# EAGLE schematic CanShark (EAGLE 6.5.0)
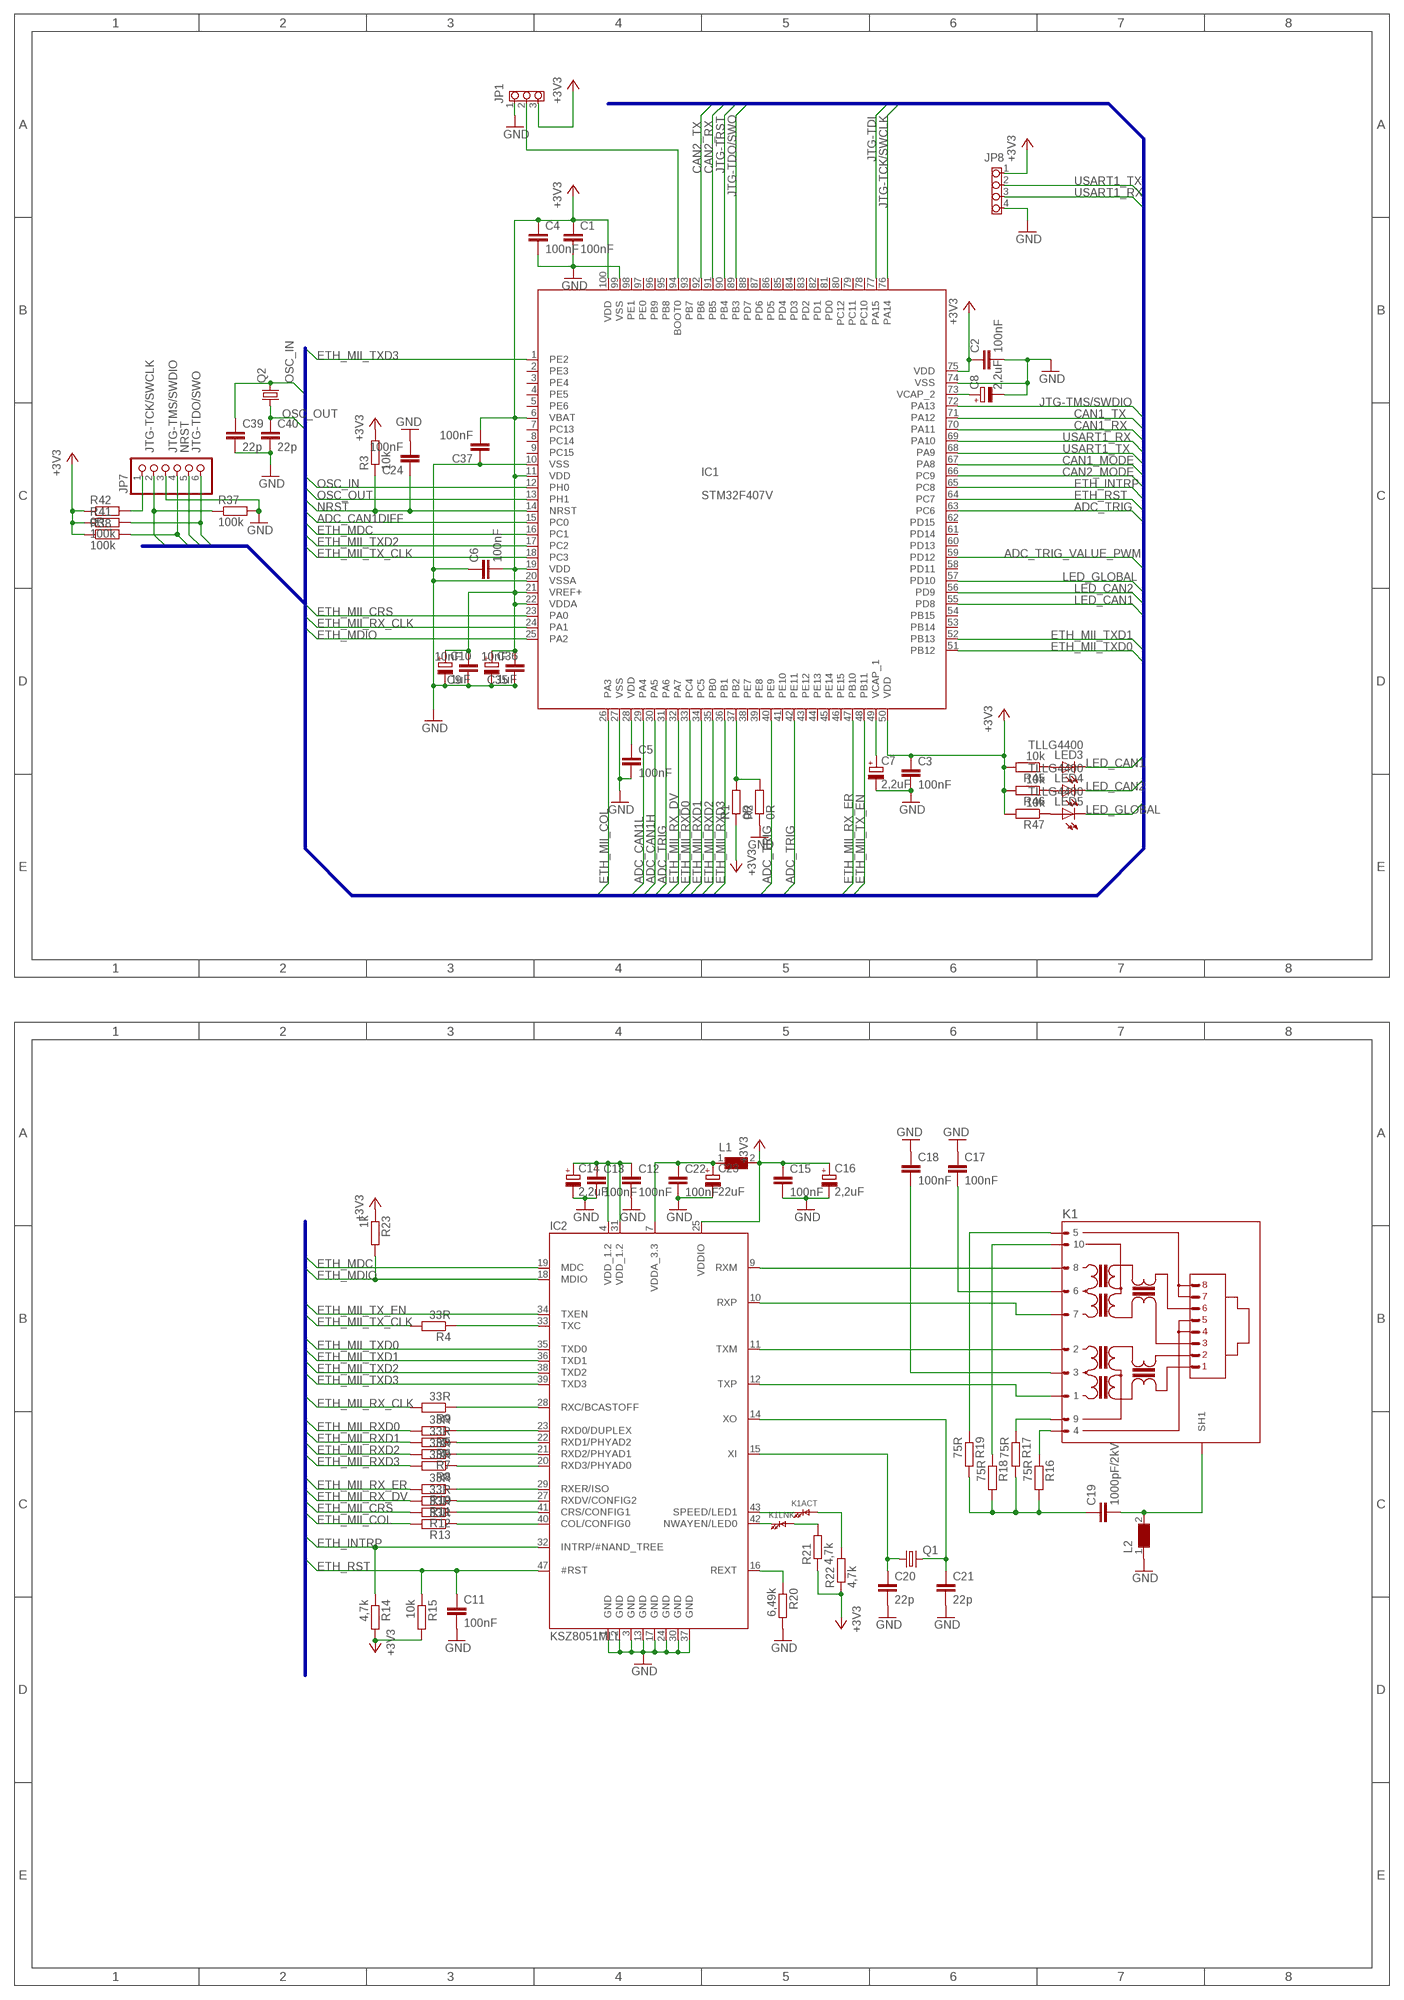
[diagram p0: schematic, sheet 1, part 1 of 3]
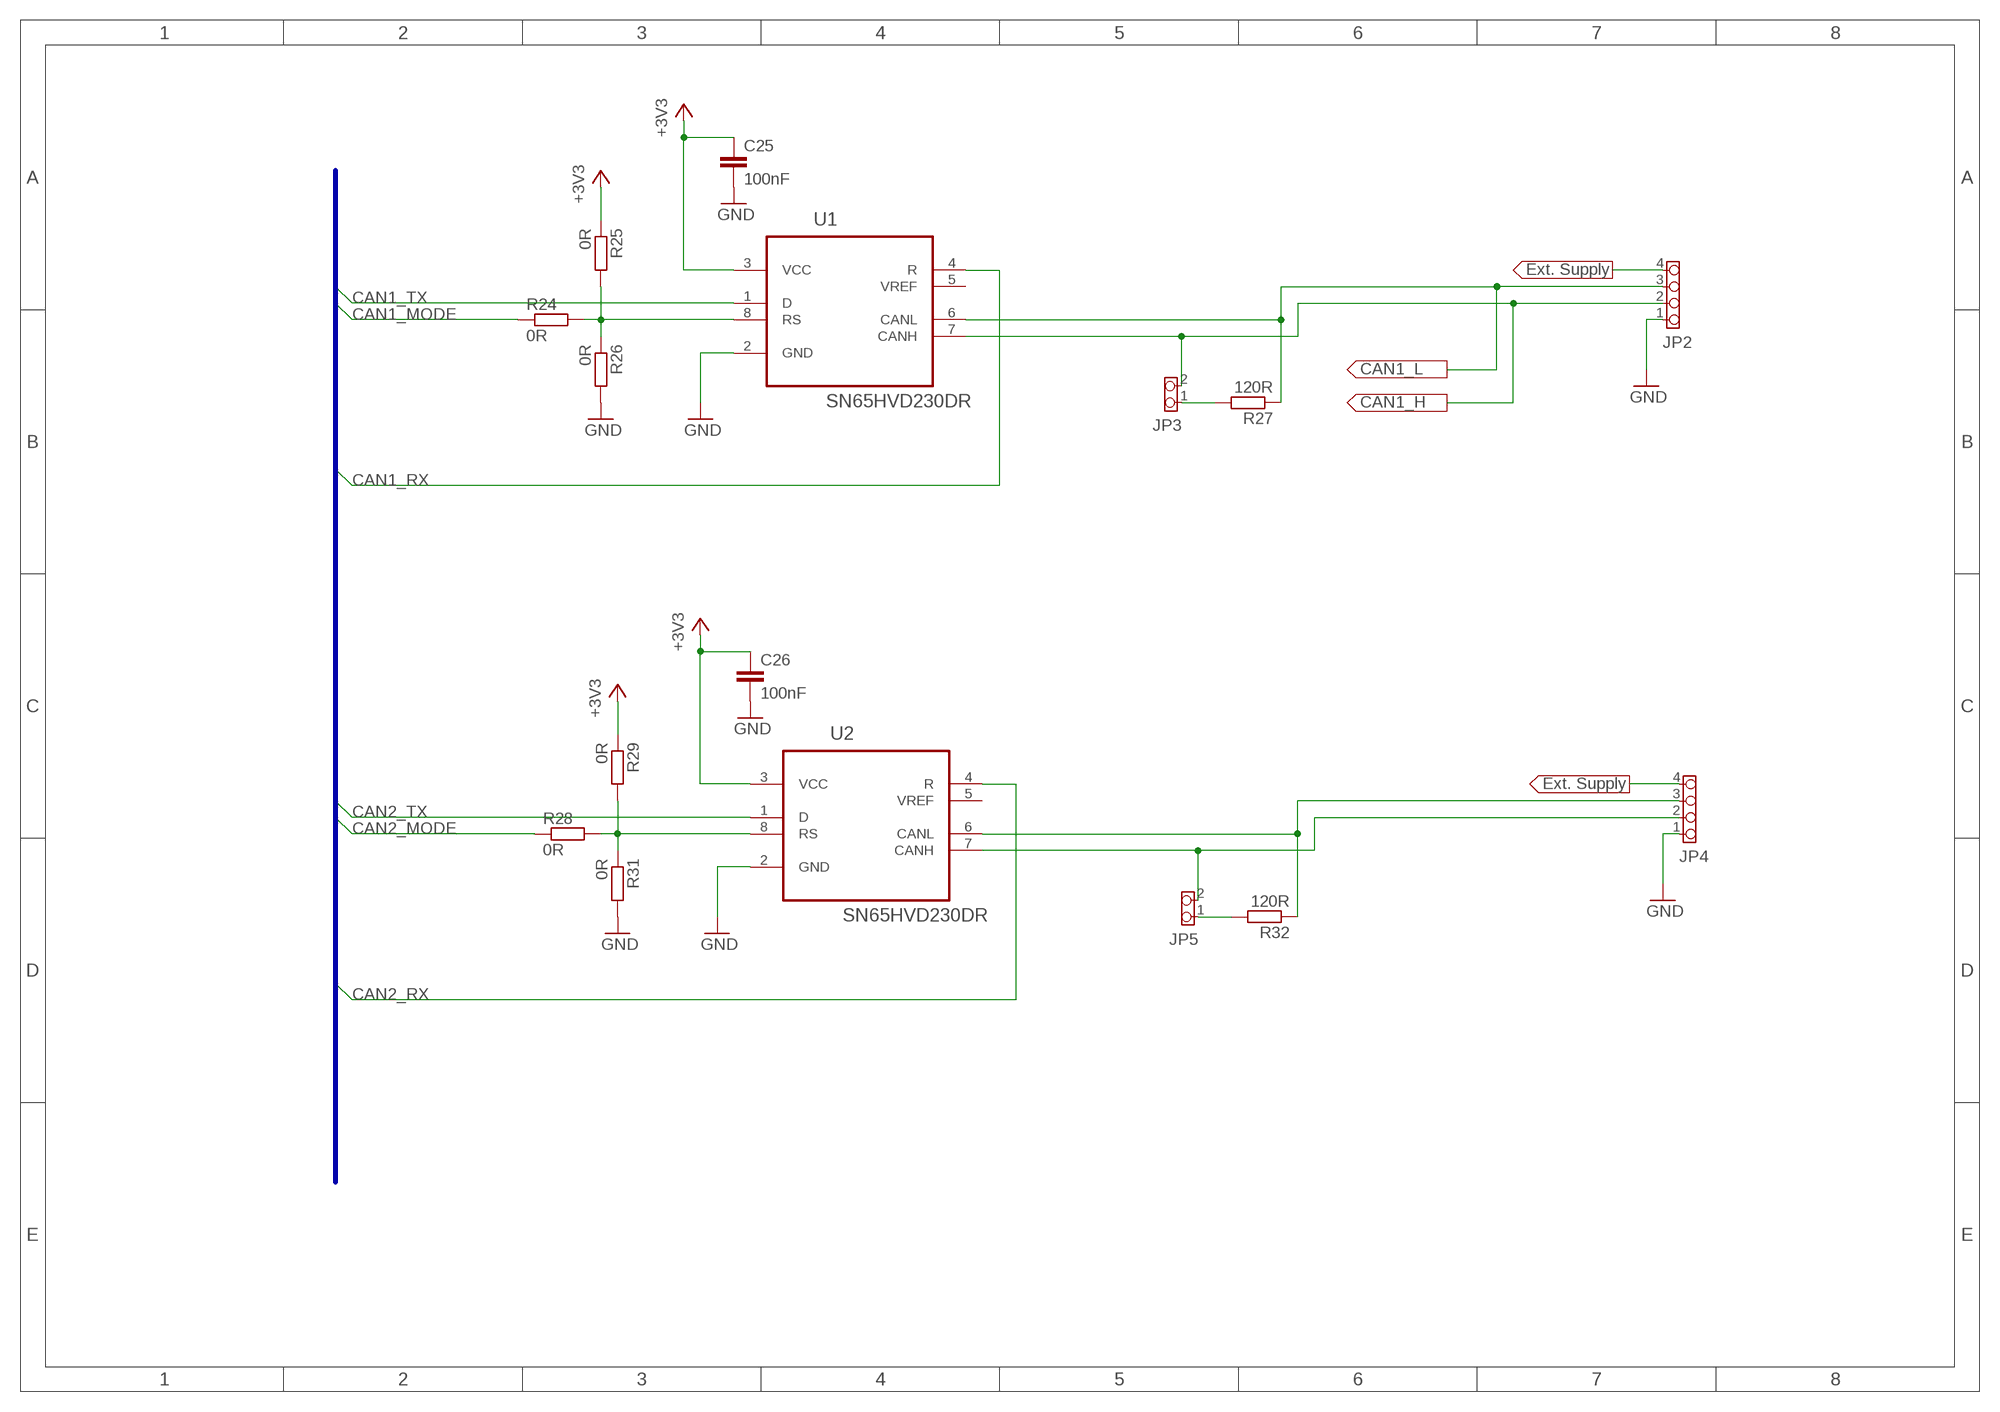
[diagram p1: schematic, sheet 1, part 2 of 3]
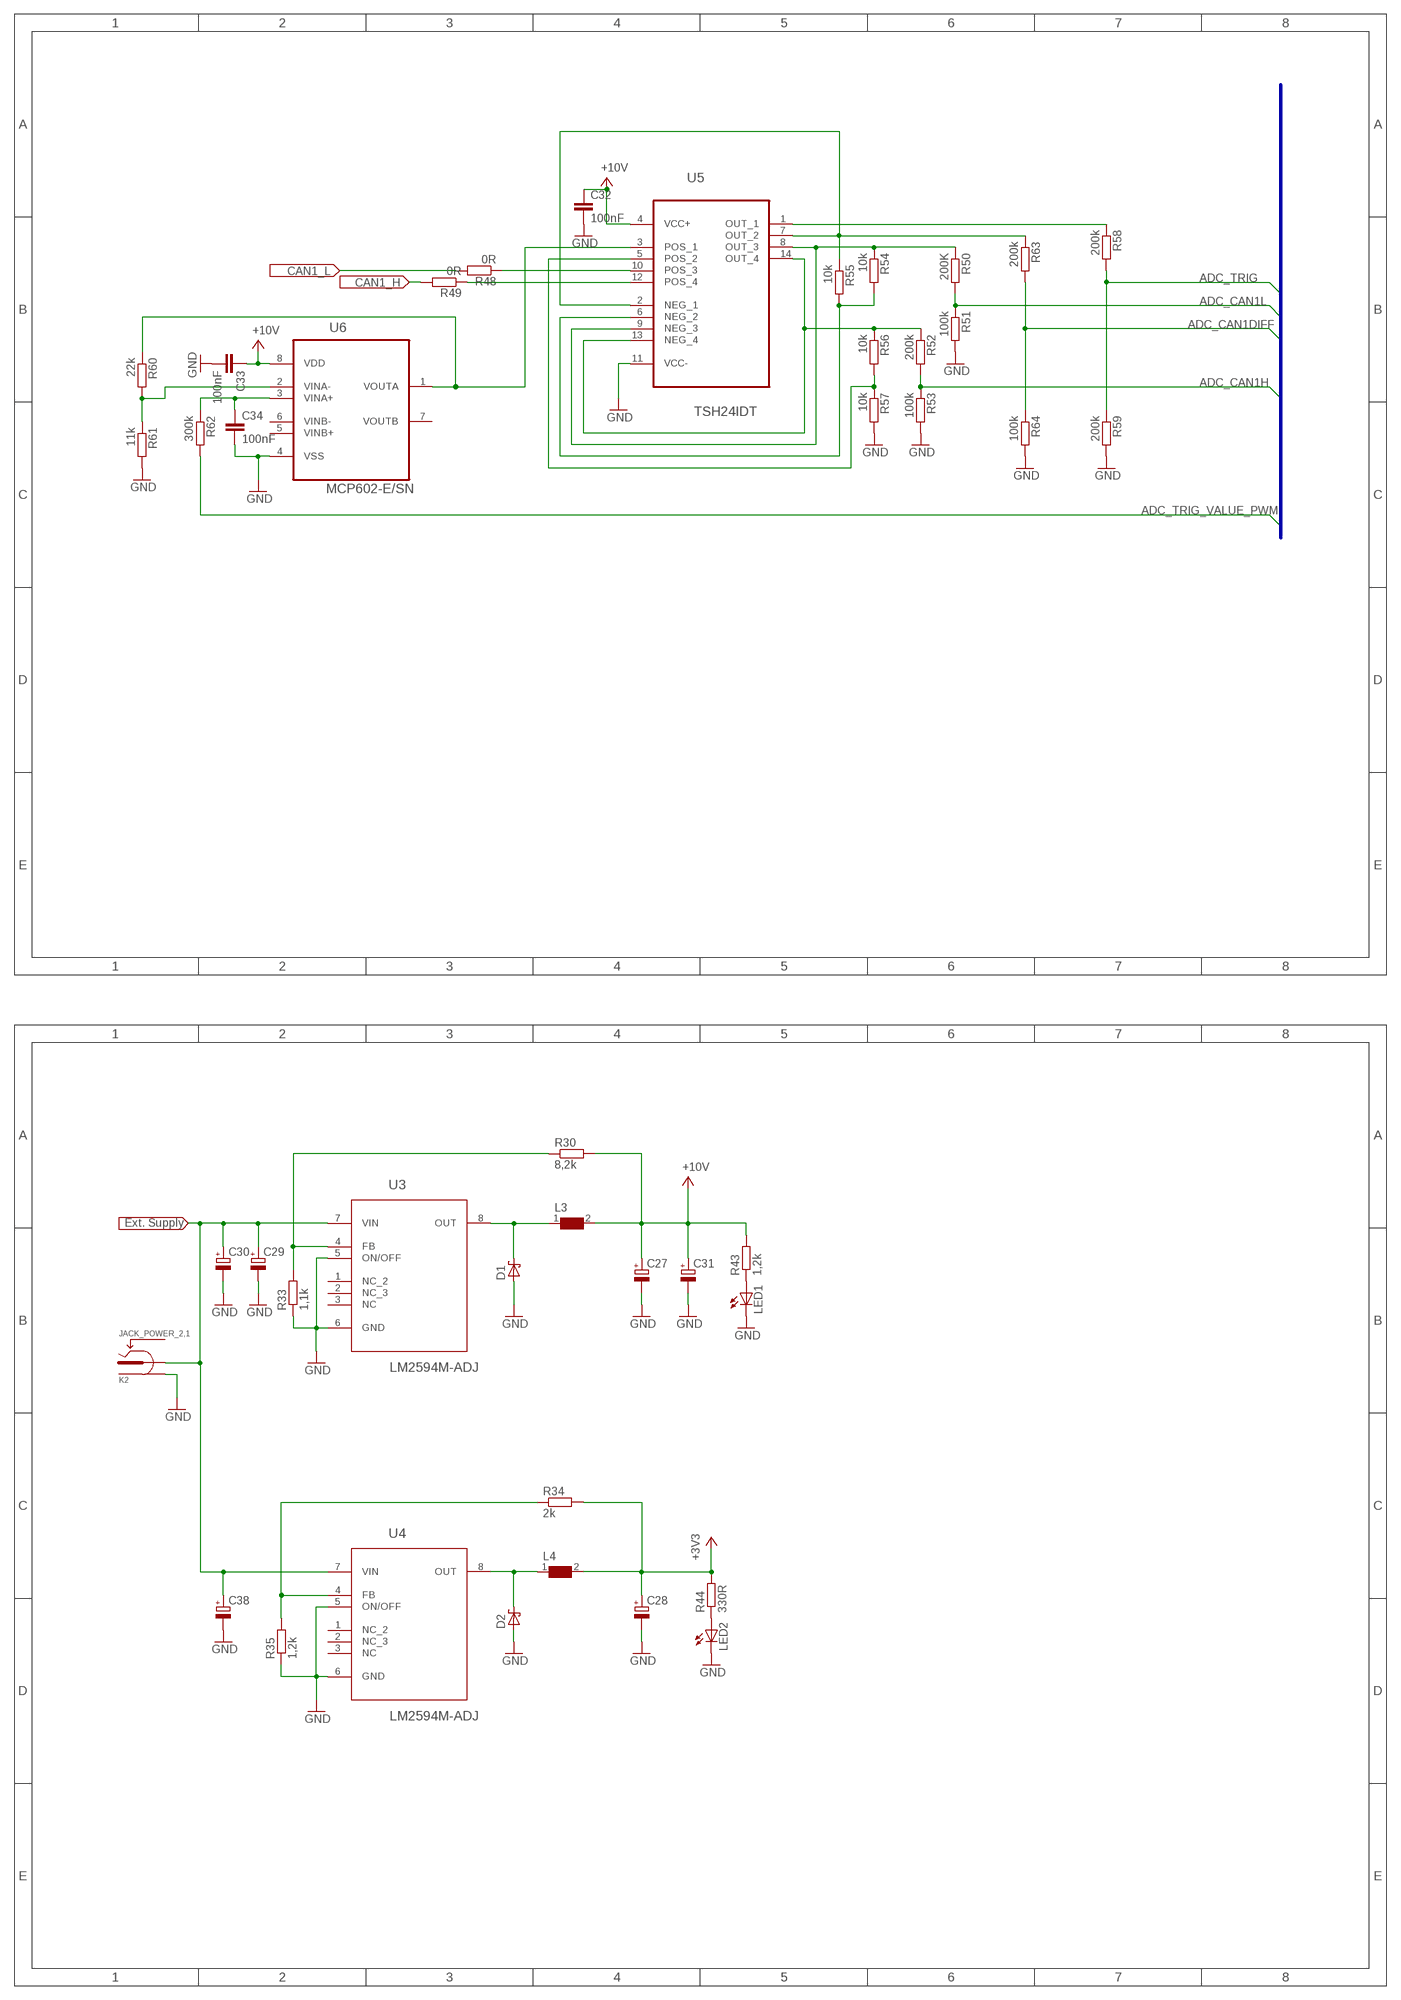
[diagram p2: schematic, sheet 1, part 3 of 3]

## Parts
C1  100nF  KERAMICKYSMD0603  [SMD0603]
C2  100nF  KERAMICKYSMD0603  [SMD0603]
C3  100nF  KERAMICKYSMD0603  [SMD0603]
C4  100nF  KERAMICKYSMD0603  [SMD0603]
C5  100nF  KERAMICKYSMD0603  [SMD0603]
C6  100nF  KERAMICKYSMD0603  [SMD0603]
C7  2,2uF  CPOL-EUSMCA  [SMC_A]
C8  2,2uF  CPOL-EUSMCA  [SMC_A]
C9  10nF  KERAMICKYSMD0603  [SMD0603]
C10  1uF  CPOL-EUSMCA  [SMC_A]
C11  100nF  KERAMICKYSMD0603  [SMD0603]
C12  100nF  KERAMICKYSMD0603  [SMD0603]
C13  100nF  KERAMICKYSMD0603  [SMD0603]
C14  2,2uF  CPOL-EUSMCA  [SMC_A]
C15  100nF  KERAMICKYSMD0603  [SMD0603]
C16  2,2uF  CPOL-EUSMCA  [SMC_A]
C17  100nF  KERAMICKYSMD0603  [SMD0603]
C18  100nF  KERAMICKYSMD0603  [SMD0603]
C19  1000pF/2kV  KERAMICKYSMD1206  [SMD1206]
C20  22p  KERAMICKYSMD0603  [SMD0603]
C21  22p  KERAMICKYSMD0603  [SMD0603]
C22  100nF  KERAMICKYSMD0603  [SMD0603]
C23  22uF  CPOL-EUSMCA  [SMC_A]
C24  100nF  KERAMICKYSMD0603  [SMD0603]
C25  100nF  KERAMICKYSMD0603  [SMD0603]
C26  100nF  KERAMICKYSMD0603  [SMD0603]
C27  CPOL-EUC/6032-28R  [C/6032-28R]
C28  CPOL-EUC/6032-28R  [C/6032-28R]
C29  CPOL-EUC/6032-28R  [C/6032-28R]
C30  CPOL-EUA/3216-18R  [A/3216-18R]
C31  CPOL-EUA/3216-18R  [A/3216-18R]
C32  100nF  KERAMICKYSMD0603  [SMD0603]
C33  100nF  KERAMICKYSMD0603  [SMD0603]
C34  100nF  KERAMICKYSMD0603  [SMD0603]
C35  10nF  KERAMICKYSMD0603  [SMD0603]
C36  1uF  CPOL-EUSMCA  [SMC_A]
C37  100nF  KERAMICKYSMD0603  [SMD0603]
C38  CPOL-EUC/6032-28R  [C/6032-28R]
C39  22p  KERAMICKYSMD0603  [SMD0603]
C40  22p  KERAMICKYSMD0603  [SMD0603]
D1  SCHOTTKY-DIODESMD  [SMB]
D2  SCHOTTKY-DIODESMD  [SMB]
IC1  STM32F407V  [LQFP100]
IC2  KSZ8051MLL  [LQFP48]
JP1  PINHD-1X3  [1X03_254]
JP2  PINHD-1X4_508_H  [1X04_508_H]
JP3  PINHD-1X2  [1X02_254]
JP4  PINHD-1X4_508_H  [1X04_508_H]
JP5  PINHD-1X2  [1X02_254]
JP7  PINHD-1X6  [1X06]
JP8  PINHD-1X4  [1X04_254]
K1  RJ45_TRAFO  [RJ45_TRAFO]
K2  JACK_POWER_2,1  [J_P_2,1]
L1  WE-CBF_HF-742863122_0603  [0603]
L2  WE-CBF_HF-742863122_0603  [0603]
L3  WE-TPC-744066180_1028/1038  [WE-TPC_1028/1038]
L4  WE-TPC-744066180_1028/1038  [WE-TPC_1028/1038]
LED1  LEDSML0603  [SML0603]
LED2  LEDSML0603  [SML0603]
LED3  TLLG4400  [LED3MM]
LED4  TLLG4400  [LED3MM]
LED5  TLLG4400  [LED3MM]
Q1  CRYSTALHC49U-V  [HC49U-V]
Q2  CRYSTALHC49U-V  [HC49U-V]
R1  0R  R-EU_R0603  [R0603]
R2  0R  R-EU_R0603  [R0603]
R3  10k  R-EU_R0603  [R0603]
R4  33R  R-EU_R0603  [R0603]
R5  33R  R-EU_R0603  [R0603]
R6  33R  R-EU_R0603  [R0603]
R7  33R  R-EU_R0603  [R0603]
R8  33R  R-EU_R0603  [R0603]
R9  33R  R-EU_R0603  [R0603]
R10  33R  R-EU_R0603  [R0603]
R11  33R  R-EU_R0603  [R0603]
R12  33R  R-EU_R0603  [R0603]
R13  33R  R-EU_R0603  [R0603]
R14  4,7k  R-EU_R0603  [R0603]
R15  10k  R-EU_R0603  [R0603]
R16  75R  R-EU_R0603  [R0603]
R17  75R  R-EU_R0603  [R0603]
R18  75R  R-EU_R0603  [R0603]
R19  75R  R-EU_R0603  [R0603]
R20  6,49k  R-EU_R0603  [R0603]
R21  4,7k  R-EU_R0603  [R0603]
R22  4,7k  R-EU_R0603  [R0603]
R23  1k  R-EU_R0603  [R0603]
R24  0R  R-EU_R0603  [R0603]
R25  0R  R-EU_R0603  [R0603]
R26  0R  R-EU_R0603  [R0603]
R27  120R  R-EU_R0603  [R0603]
R28  0R  R-EU_R0603  [R0603]
R29  0R  R-EU_R0603  [R0603]
R30  8,2k  R-EU_R0603  [R0603]
R31  0R  R-EU_R0603  [R0603]
R32  120R  R-EU_R0603  [R0603]
R33  1,1k  R-EU_R0603  [R0603]
R34  2k  R-EU_R0603  [R0603]
R35  1,2k  R-EU_R0603  [R0603]
R37  100k  R-EU_R0603  [R0603]
R38  100k  R-EU_R0603  [R0603]
R41  100k  R-EU_R0603  [R0603]
R42  0R  R-EU_R0603  [R0603]
R43  1,2k  R-EU_R0603  [R0603]
R44  330R  R-EU_R0603  [R0603]
R45  10k  R-EU_R0603  [R0603]
R46  10k  R-EU_R0603  [R0603]
R47  10k  R-EU_R0603  [R0603]
R48  0R  R-EU_R0603  [R0603]
R49  0R  R-EU_R0603  [R0603]
R50  200K  R-EU_R0603  [R0603]
R51  100k  R-EU_R0603  [R0603]
R52  200k  R-EU_R0603  [R0603]
R53  100k  R-EU_R0603  [R0603]
R54  10k  R-EU_R0603  [R0603]
R55  10k  R-EU_R0603  [R0603]
R56  10k  R-EU_R0603  [R0603]
R57  10k  R-EU_R0603  [R0603]
R58  200k  R-EU_R0603  [R0603]
R59  200k  R-EU_R0603  [R0603]
R60  22k  R-EU_R0603  [R0603]
R61  11k  R-EU_R0603  [R0603]
R62  300k  R-EU_R0603  [R0603]
R63  200k  R-EU_R0603  [R0603]
R64  100k  R-EU_R0603  [R0603]
U1  SN65HVD230DR  [SOIC127P600X175-8N]
U2  SN65HVD230DR  [SOIC127P600X175-8N]
U3  LM2594M-ADJ  [SOIC127P620X175-8N]
U4  LM2594M-ADJ  [SOIC127P620X175-8N]
U5  TSH24IDT  [SOIC127P600X175-14N]
U6  MCP602-E/SN  [SOIC127P600X175-8N]

## Nets
+3V3: C1.1 C2.1 C3.1 C4.1 C6.2 C9.2 C10.+ C15.1 C16.+ C25.1 C26.1 C28.+ C35.2 C36.+ C37.2 IC1.6(VBAT) IC1.11(VDD) IC1.19(VDD) IC1.21(VREF+) IC1.22(VDDA) IC1.50(VDD) IC1.75(VDD) IC1.100(VDD) IC2.25(VDDIO) JP1.3 JP8.1 L1.2 L4.2 R1.1 R3.2 R14.2 R15.2 R21.1 R22.1 R23.1 R25.1 R29.1 R34.2 R38.1 R41.1 R42.1 R44.2 R45.2 R46.2 R47.2 U1.3(VCC) U2.3(VCC)
ADC_CAN1DIFF: IC1.15(PC0) R63.2 R64.1
ADC_CAN1H: IC1.30(PA5) R52.2 R53.1
ADC_CAN1L: IC1.29(PA4) R50.2 R51.1
ADC_TRIG: IC1.31(PA6) IC1.40(PE9) IC1.42(PE11) IC1.63(PC6) R58.2 R59.1
ADC_TRIG_VALUE_PWM: IC1.59(PD12) R62.2
CAN1_H: JP2.2 JP3.2 R49.2 U1.7(CANH)
CAN1_L: JP2.3 R27.1 R48.2 U1.6(CANL)
CAN1_MODE: IC1.67(PA8) R24.1
CAN1_RX: IC1.70(PA11) U1.4(R)
CAN1_TX: IC1.71(PA12) U1.1(D)
CAN2_MODE: IC1.66(PC9) R28.1
CAN2_RX: IC1.91(PB5) U2.4(R)
CAN2_TX: IC1.92(PB6) U2.1(D)
CANL: JP4.3 R32.1 U2.6(CANL)
ETH_INTRP: IC1.65(PC8) IC2.32(INTRP/#NAND_TREE) R14.1
ETH_MDC: IC1.16(PC1) IC2.19(MDC)
ETH_MDIO: IC1.25(PA2) IC2.18(MDIO) R23.2
ETH_MII_COL: IC1.26(PA3) R13.2
ETH_MII_CRS: IC1.23(PA0) R12.2
ETH_MII_RX_CLK: IC1.24(PA1) R9.2
ETH_MII_RX_DV: IC1.32(PA7) R11.2
ETH_MII_RX_ER: IC1.47(PB10) R10.2
ETH_MII_RXD0: IC1.33(PC4) R5.2
ETH_MII_RXD1: IC1.34(PC5) R6.2
ETH_MII_RXD2: IC1.35(PB0) R7.2
ETH_MII_RXD3: IC1.36(PB1) R8.2
ETH_MII_TX_CLK: IC1.18(PC3) R4.2
ETH_MII_TX_EN: IC1.48(PB11) IC2.34(TXEN)
ETH_MII_TXD0: IC1.51(PB12) IC2.35(TXD0)
ETH_MII_TXD1: IC1.52(PB13) IC2.36(TXD1)
ETH_MII_TXD2: IC1.17(PC2) IC2.38(TXD2)
ETH_MII_TXD3: IC1.1(PE2) IC2.39(TXD3)
ETH_RST: C11.1 IC1.64(PC7) IC2.47(#RST) R15.1
EXTSUPPLY: C29.+ C30.+ C38.+ JP2.4 JP4.4 K2.A U3.7(VIN) U4.7(VIN)
GND: C1.2 C2.2 C3.2 C4.2 C5.2 C6.1 C7.- C8.- C9.1 C10.- C11.2 C12.2 C13.2 C14.- C15.2 C16.- C17.1 C18.1 C20.2 C21.2 C22.2 C23.- C24.2 C25.2 C26.2 C27.- C28.- C29.- C30.- C31.- C32.2 C33.2 C34.2 C35.1 C36.- C37.1 C38.- C39.2 C40.2 D1.A D2.A IC1.10(VSS) IC1.20(VSSA) IC1.27(VSS) IC1.74(VSS) IC1.99(VSS) IC2.1(GND) IC2.2(GND) IC2.3(GND) IC2.13(GND) IC2.17(GND) IC2.24(GND) IC2.30(GND) IC2.37(GND) JP1.1 JP2.1 JP4.1 JP7.3 JP8.4 K2.B L2.1 LED1.C LED2.C R2.1 R20.2 R26.2 R31.2 R33.1 R35.1 R37.2 R51.2 R53.2 R57.2 R59.2 R61.2 R64.2 U1.2(GND) U2.2(GND) U3.5(ON/OFF) U3.6(GND) U4.5(ON/OFF) U4.6(GND) U5.11(VCC-) U6.4(VSS)
JTG-TCK/SWCLK: IC1.76(PA14) JP7.2 R37.1
JTG-TDI: IC1.77(PA15)
JTG-TDO/SWO: IC1.89(PB3) JP7.6 R41.2
JTG-TMS/SWDIO: IC1.72(PA13) JP7.4 R38.2
JTG-TRST: IC1.90(PB4)
LED_CAN1: IC1.55(PD8) LED3.K(C)
LED_CAN2: IC1.56(PD9) LED4.K(C)
LED_GLOBAL: IC1.57(PD10) LED5.K(C)
N$1: IC1.94(BOOT0) JP1.2
N$2: C7.+ IC1.49(VCAP_1)
N$3: C5.1 IC1.28(VDD)
N$4: C8.+ IC1.73(VCAP_2)
N$5: JP3.1 R27.2
N$6: IC1.37(PB2) R1.2 R2.2
N$7: D1.C L3.1 U3.8(OUT)
N$9: C22.1 C23.+ IC2.7(VDDA_3.3) L1.1
N$10: IC2.33(TXC) R4.1
N$12: R24.2 R25.2 R26.1 U1.8(RS)
N$14: JP4.2 JP5.2 U2.7(CANH)
N$16: IC2.28(RXC/BCASTOFF) R9.1
N$17: R28.2 R29.2 R31.1 U2.8(RS)
N$18: IC2.23(RXD0/DUPLEX) R5.1
N$19: IC2.22(RXD1/PHYAD2) R6.1
N$20: IC2.21(RXD2/PHYAD1) R7.1
N$21: IC2.20(RXD3/PHYAD0) R8.1
N$22: IC2.29(RXER/ISO) R10.1
N$23: IC2.27(RXDV/CONFIG2) R11.1
N$24: IC2.41(CRS/CONFIG1) R12.1
N$25: IC2.40(COL/CONFIG0) R13.1
N$26: JP5.1 R32.2
N$27: JP7.1 R42.2
N$28: D2.C L4.1 U4.8(OUT)
N$29: R34.1 R35.2 U4.4(FB)
N$30: R30.1 R33.2 U3.4(FB)
N$35: LED1.A R43.1
N$36: C12.1 C13.1 C14.+ IC2.4(VDD_1.2) IC2.31(VDD_1.2)
N$37: IC2.9(RXM) K1.8
N$38: IC2.10(RXP) K1.7
N$39: IC2.11(TXM) K1.2
N$40: IC2.12(TXP) K1.1
N$41: K1.4 R16.1
N$42: K1.9 R17.1
N$43: K1.10 R18.1
N$44: K1.5 R19.1
N$45: C19.1 R16.2 R17.2 R18.2 R19.2
N$46: C17.2 K1.6
N$47: C18.2 K1.3
N$48: C19.2 K1.SH1 K1.SH2(SH1) L2.2
N$49: IC2.16(REXT) R20.1
N$50: IC2.42(NWAYEN/LED0) K1.K_G(K)
N$51: IC2.43(SPEED/LED1) K1.K_Y(K)
N$52: K1.A_Y(A) R22.2
N$53: K1.A_G(A) R21.2
N$54: LED2.A R44.1
N$55: C21.1 IC2.14(XO) Q1.2
N$56: C20.1 IC2.15(XI) Q1.1
N$57: LED3.A R45.1
N$58: LED4.A R46.1
N$59: LED5.A R47.1
N$60: R52.1 R56.1 U5.13(NEG_4) U5.14(OUT_4)
N$61: R50.1 R54.1 U5.8(OUT_3) U5.9(NEG_3)
N$62: R49.1 U5.12(POS_4)
N$63: R48.1 U5.10(POS_3)
N$65: R55.1 R63.1 U5.2(NEG_1) U5.7(OUT_2)
N$66: R54.2 R55.2 U5.6(NEG_2)
N$67: R56.2 R57.1 U5.5(POS_2)
N$68: R60.1 U5.3(POS_1) U6.1(VOUTA)
N$69: R58.1 U5.1(OUT_1)
N$70: R60.2 R61.1 U6.2(VINA-)
N$71: C34.1 R62.1 U6.3(VINA+)
NRST: C24.1 IC1.14(NRST) JP7.5 R3.1
OSC_IN: C39.1 IC1.12(PH0) Q2.2
OSC_OUT: C40.1 IC1.13(PH1) Q2.1
USART1_RX: IC1.69(PA10) JP8.3
USART1_TX: IC1.68(PA9) JP8.2
V+: C27.+ C31.+ C32.1 C33.1 L3.2 R30.2 R43.2 U5.4(VCC+) U6.8(VDD) ; supply symbol labelled +10V
Unconnected: IC1.2(PE3) IC1.3(PE4) IC1.4(PE5) IC1.5(PE6) IC1.7(PC13) IC1.8(PC14) IC1.9(PC15) IC1.38(PE7) IC1.39(PE8) IC1.41(PE10) IC1.43(PE12) IC1.44(PE13) IC1.45(PE14) IC1.46(PE15) IC1.53(PB14) IC1.54(PB15) IC1.58(PD11) IC1.60(PD13) IC1.61(PD14) IC1.62(PD15) IC1.78(PC10) IC1.79(PC11) IC1.80(PC12) IC1.81(PD0) IC1.82(PD1) IC1.83(PD2) IC1.84(PD3) IC1.85(PD4) IC1.86(PD5) IC1.87(PD6) IC1.88(PD7) IC1.93(PB7) IC1.95(PB8) IC1.96(PB9) IC1.97(PE0) IC1.98(PE1) K2.BK U1.5(VREF) U2.5(VREF) U3.1(NC_2) U3.2(NC_3) U3.3(NC) U4.1(NC_2) U4.2(NC_3) U4.3(NC) U6.5(VINB+) U6.6(VINB-) U6.7(VOUTB)

## Buses
ADC_TRIG,ADC_CAN1L,ADC_CAN1H,ADC_TRIG_VALUE_PWM,CAN2_TX,CAN2_RX,CAN2_MODE,CAN1_TX,CAN1_RX,CAN1_MODE,ETH_MDC,ETH_MDIO,ETH_MII_TX_EN,ETH_MII_TX_CLK,ETH_MII_TXD[0..3],ETH_MII_RX_CLK,ETH_MII_RXD[0..3],ETH_MII_RX_ER,ETH_MII_RX_DV,ETH_MII_CRS,ETH_MII_COL,ETH_INTRP,ETH_RST,JTG-TRST,JTG-TDI,JTG-TMS/SWDIO,JTG-TCK/SWCLK,JTG-TDO/SWO,NRST,ADC_CAN1DIFF,LED_CAN1,LED_CAN2,LED_GLOBAL,USART1_TX,USART1_RX,OSC_IN,OSC_OUT

## Library data of the parts
C1-C6 C9 C11-C13 C15 C17-C22 C24-C26 C32-C35 C37 C39 C40 = #Kondenzatory:KERAMICKY
C7 C8 C10 C14 C16 C23 C27-C31 C36 C38 = rcl:CPOL-EU: POLARIZED CAPACITOR, European symbol
D1 D2 = diode:SCHOTTKY-DIODE: Schottky Diode
IC1 = !ic_stm32:STM32F4*V: IC Mikrokontroler
IC2 = !ic_micrel:KSZ8051MLL: IO - Ethernet PHY
JP1 = !pinhead:PINHD-1X3: Konektor 3 PIN Typ Rastr Imax Umax Rmax Kontakt 2.54 mm 500 mA 125 V 50 mOhm krimp /90 2.54 mm 500 mA 125 V 50 mOhm krimp _MX5267 2.50 mm 2.5 A 250 V 20 mOhm krimp _MX53048 1.25 mm 800 mA 125 V 20 mOhm krimp _PV-3.81 3.81 mm 8 A 130 V 30 mOhm ?roub
JP2 JP4 JP8 = !pinhead:PINHD-1X4: Konektor 4 PIN Typ Rastr Imax Umax Rmax Kontakt 2.54 mm 500 mA 125 V 50 mOhm krimp /90 2.54 mm 500 mA 125 V 50 mOhm krimp _MX5267 2.50 mm 2.5 A 250 V 20 mOhm krimp _MX53048 1.25 mm 800 mA 125 V 20 mOhm krimp _PV-3.81 3.81 mm 8 A 130 V 30 mOhm ?roub
JP3 JP5 = !pinhead:PINHD-1X2: Konektor 2 PIN Typ Rastr Imax Umax Rmax Kontakt 2.54 mm 500 mA 125 V 50 mOhm krimp /90 2.54 mm 500 mA 125 V 50 mOhm krimp _MX5267 2.50 mm 2.5 A 250 V 20 mOhm krimp _MX53048 1.25 mm 800 mA 125 V 20 mOhm krimp _PV-3.81 3.81 mm 8 A 130 V 30 mOhm ?roub
JP7 = pinhead:PINHD-1X6: PIN HEADER
K1 = !konektor:RJ45_TRAFO: Konektor RJ45 RJ45 socket with LED and transofrmator Manufaturer: Wenzhou Yihua Communicated Connector Co. Ltd. Forward current LED = 20mA Typical voltage: Green LED Yellow LED 2.2V 2.1V c 2007 ROFA.CZ
K2 = !konektor:JACK_POWER_?
L1 L2 = WE-CBF_HF:WE-CBF_HF: SMD EMI Suppression Ferrite Beads WE-CBF HF; MPN: 742863122; OC_FARNELL: 1748575; OC_NEWARK: 34R5899; PACKAGE: IND-0603_1; SUPPLIER: Wuerth Elektronik
L3 L4 = WE-TPC:WE-TPC: Shielded Tiny Power Inductor WE-TPC - Extremely flat power inductor - High current capability - High reliability and perfect soldering characteristics because of integrated soldering pad - magnetically shielded -- Portable power like PDA, digital camera, PCMICA-cards and displays -- DC/DC-converter -- Recommended for switching regulator IC's from Linear Technology, National Semiconductor, Texas Instruments and Fairchild Semiconductor; MPN: 744066180; OC_FARNELL: 2211515; OC_NEWARK: 44W4565; PACKAGE: 1038; SUPPLIER: WURTH ELEKTRONIK
LED1 LED2 = led:LED: LED OSRAM: - CHIPLED LG R971, LG N971, LY N971, LG Q971, LY Q971, LO R971, LY R971 LH N974, LH R974 LS Q976, LO Q976, LY Q976 LO Q996 - Hyper CHIPLED LW Q18S LB Q993, LB Q99A, LB R99A - SideLED LS A670, LO A670, LY A670, LG A670, LP A670 LB A673, LV A673, LT A673, LW A673 LH A674 LY A675 LS A676, LA A676, LO A676, LY A676, LW A676 LS A679, LY A679, LG A679 - Hyper Micro SIDELED® LS Y876, LA Y876, LO Y876, LY Y876 LT Y87S - SmartLED LW L88C, LW L88S LB L89C, LB L89S, LG L890 LS L89K, LO L89K, LY L89K LS L896, LA L896, LO L896, LY L896 - TOPLED LS T670, LO T670, LY T670, LG T670, LP T670 LSG T670, LSP T670, LSY T670, LOP T670, LYG T670 LG T671, LOG T671, LSG T671 LB T673, LV T673, LT T673, LW T673 LH T674 LS T676, LA T676, LO T676, LY T676, LB T676, LH T676, LSB T676, LW T676 LB T67C, LV T67C, LT T67C, LS T67K, LO T67K, LY T67K, LW E67C LS E67B, LA E67B, LO E67B, LY E67B, LB E67C, LV E67C, LT E67C LW T67C LS T679, LY T679, LG T679 LS T770, LO T770, LY T770, LG T770, LP T770 LB T773, LV T773, LT T773, LW T773 LH T774 LS E675, LA E675, LY E675, LS T675 LS T776, LA T776, LO T776, LY T776, LB T776 LHGB T686 LT T68C, LB T68C - Hyper Mini TOPLED® LB M676 - Mini TOPLED Santana® LG M470 LS M47K, LO M47K, LY M47K Source: http://www.osram.convergy.de LUXEON: - LUMILED® LXK2-PW12-R00, LXK2-PW12-S00, LXK2-PW14-U00, LXK2-PW14-V00 LXK2-PM12-R00, LXK2-PM12-S00, LXK2-PM14-U00 LXK2-PE12-Q00, LXK2-PE12-R00, LXK2-PE12-S00, LXK2-PE14-T00, LXK2-PE14-U00 LXK2-PB12-K00, LXK2-PB12-L00, LXK2-PB12-M00, LXK2-PB14-N00, LXK2-PB14-P00, LXK2-PB14-Q00 LXK2-PR12-L00, LXK2-PR12-M00, LXK2-PR14-Q00, LXK2-PR14-R00 LXK2-PD12-Q00, LXK2-PD12-R00, LXK2-PD12-S00 LXK2-PH12-R00, LXK2-PH12-S00 LXK2-PL12-P00, LXK2-PL12-Q00, LXK2-PL12-R00 Source: www.luxeon.com KINGBRIGHT: KA-3528ASYC Source: www.kingbright.com
LED3-LED5 = led:TLLG4400: Low Current (2mA) LED 3 mm Tinted Diffused Package color GREEN Source: Data sheet <http://www.farnell.com/datasheets/391098.pdf>; MF: VISHAY SEMICONDUCTOR; OC_FARNELL: 1612435
Q1 Q2 = crystal:CRYSTAL: CRYSTAL; OC_FARNELL: 1666969; OC_NEWARK: unknown
R1-R35 R37 R38 R41-R64 = #Odpory:R-EU_: RESISTOR, European symbol
U1 U2 = TI_SM65HVD230_CAN_DRIVER:SN65HVD230DR: 3.3-V CAN TRANSCEIVERS; MPN: SN65HVD230DR; OC_FARNELL: 8452148; OC_NEWARK: 75C7745; PACKAGE: SOIC-8; SUPPLIER: Texas Instruments
U3 U4 = LM2594M-ADJ:LM2594M-ADJ: SIMPLE SWITCHER® Power Converter; MPN: LM2594M-ADJ; OC_FARNELL: 9494332; OC_NEWARK: 41K3819; PACKAGE: 8-SOIC; SUPPLIER: National Semiconductors
U5 = TSH24IDT:TSH24IDT: OPERATIONAL AMPLIFIERS; MPN: TSH24IDT; OC_FARNELL: 1750176; OC_NEWARK: 33R1395; PACKAGE: SOIC-14; SUPPLIER: STMICROELECTRONICS
U6 = MCP602:MCP602-E/SN: IC, 2.7V to 5.5V Single-Supply CMOS Dual Op Amps,SOIC-8; MPN: MCP602-E/SN; OC_FARNELL: 1852043; OC_NEWARK: 88H9871; PACKAGE: SOIC-8; SUPPLIER: Microchip